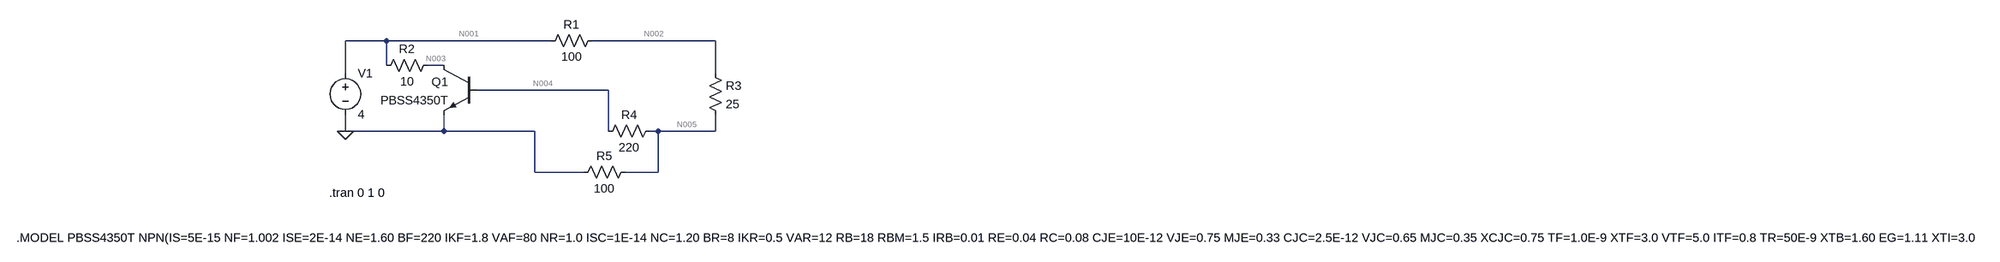
[diagram p0: schematic cell balance.asc]
cell balance.asc, the LTspice schematic file:
Version 4
SHEET 1 2132 680
WIRE -112 48 -192 48
WIRE 208 48 -112 48
WIRE 528 48 288 48
WIRE -112 96 -112 48
WIRE 0 96 -32 96
WIRE -192 112 -192 48
WIRE 528 112 528 48
WIRE 320 144 64 144
WIRE -192 224 -192 192
WIRE 0 224 0 192
WIRE 0 224 -192 224
WIRE 176 224 0 224
WIRE 320 224 320 144
WIRE 416 224 400 224
WIRE 528 224 528 192
WIRE 528 224 416 224
WIRE 176 304 176 224
WIRE 272 304 176 304
WIRE 416 304 416 224
WIRE 416 304 352 304
FLAG -192 224 0
SYMBOL voltage -192 96 R0
WINDOW 123 0 0 Left 0
WINDOW 39 0 0 Left 0
SYMATTR InstName V1
SYMATTR Value 4
SYMBOL res 304 32 R90
WINDOW 0 0 56 VBottom 2
WINDOW 3 32 56 VTop 2
SYMATTR InstName R1
SYMATTR Value 100
SYMBOL res 512 96 R0
SYMATTR InstName R3
SYMATTR Value 25
SYMBOL res 416 208 R90
WINDOW 0 0 56 VBottom 2
WINDOW 3 32 56 VTop 2
SYMATTR InstName R4
SYMATTR Value 220
SYMBOL res 368 288 R90
WINDOW 0 0 56 VBottom 2
WINDOW 3 32 56 VTop 2
SYMATTR InstName R5
SYMATTR Value 100
SYMBOL npn 64 96 M0
SYMATTR InstName Q1
SYMATTR Value PBSS4350T
SYMBOL res -16 80 R90
WINDOW 0 0 56 VBottom 2
WINDOW 3 32 56 VTop 2
SYMATTR InstName R2
SYMATTR Value 10
TEXT -224 344 Left 2 !.tran 0 1 0
TEXT -832 432 Left 2 !.MODEL PBSS4350T NPN(IS=5E-15 NF=1.002 ISE=2E-14 NE=1.60 BF=220 IKF=1.8 VAF=80 NR=1.0 ISC=1E-14 NC=1.20 BR=8 IKR=0.5 VAR=12 RB=18 RBM=1.5 IRB=0.01 RE=0.04 RC=0.08 CJE=10E-12 VJE=0.75 MJE=0.33 CJC=2.5E-12 VJC=0.65 MJC=0.35 XCJC=0.75 TF=1.0E-9 XTF=3.0 VTF=5.0 ITF=0.8 TR=50E-9 XTB=1.60 EG=1.11 XTI=3.0 FC=0.5)

The netlist it stands for:
* cell balance.asc
V1 N001 0 4
R1 N002 N001 100
R3 N002 N005 25
R4 N005 N004 220
R5 N005 0 100
Q1 N003 N004 0 0 PBSS4350T
R2 N003 N001 10
.model NPN NPN
.model PNP PNP
.lib standard.bjt
.tran 0 1 0
.MODEL PBSS4350T NPN(IS=5E-15 NF=1.002 ISE=2E-14 NE=1.60 BF=220 IKF=1.8 VAF=80 NR=1.0 ISC=1E-14 NC=1.20 BR=8 IKR=0.5 VAR=12 RB=18 RBM=1.5 IRB=0.01 RE=0.04 RC=0.08 CJE=10E-12 VJE=0.75 MJE=0.33 CJC=2.5E-12 VJC=0.65 MJC=0.35 XCJC=0.75 TF=1.0E-9 XTF=3.0 VTF=5.0 ITF=0.8 TR=50E-9 XTB=1.60 EG=1.11 XTI=3.0 FC=0.5)
.backanno
.end

* Results of the author's LTspice run, read from the files saved beside the schematic
* Operating Point, zero values left out:
*   V(n001) = 4 V
*   V(n002) = 2.08 V
*   V(n005) = 1.599 V
*   V(n004) = 893.3 mV
*   V(n003) = 165.1 mV
*   Ic(Q1) = 383.5 mA
*   Ib(Q1) = 3.209 mA
*   Ie(Q1) = -386.7 mA
*   I(R2) = -383.5 mA
*   I(R5) = 15.99 mA
*   I(R4) = 3.21 mA
*   I(R3) = 19.2 mA
*   I(R1) = -19.2 mA
*   I(V1) = -402.7 mA
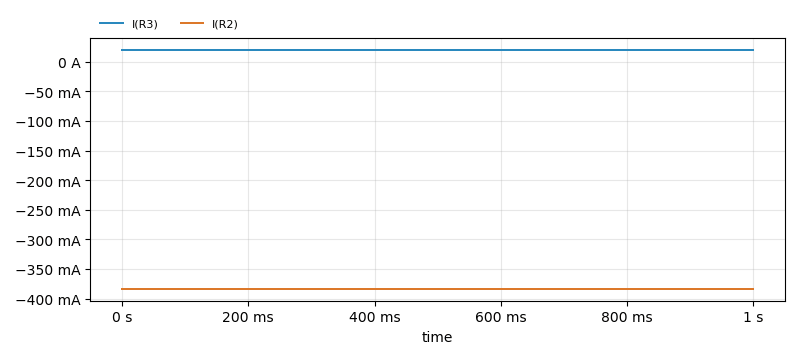
[diagram p1: Transient Analysis of cell balance.asc, plotted from the saved traces]
* Transient Analysis, 1 run:
*   I(R3): min 19.2 mA, max 19.2 mA, average 19.2 mA, rms 19.2 mA, last 19.2 mA
*   I(R2): min -383.5 mA, max -383.5 mA, average -383.5 mA, rms 383.5 mA, last -383.5 mA